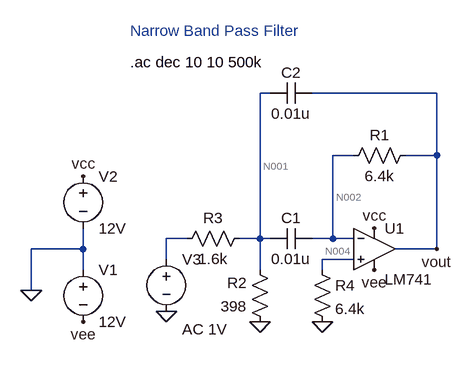
[diagram p0: schematic narrow_band_pass.asc]
narrow_band_pass.asc, the LTspice schematic file:
Version 4.1
SHEET 1 880 680
WIRE 400 -128 384 -128
WIRE 656 -128 464 -128
WIRE 528 -32 496 -32
WIRE 656 -32 656 -128
WIRE 656 -32 608 -32
WIRE 272 96 240 96
WIRE 384 96 384 -128
WIRE 384 96 352 96
WIRE 400 96 384 96
WIRE 496 96 496 -32
WIRE 496 96 464 96
WIRE 528 96 496 96
WIRE 112 112 112 80
WIRE 112 112 32 112
WIRE 656 112 656 -32
WIRE 656 112 592 112
WIRE 240 128 240 96
WIRE 528 128 480 128
WIRE 112 144 112 112
WIRE 384 144 384 96
WIRE 480 144 480 128
WIRE 32 176 32 112
FLAG 32 176 0
FLAG 480 224 0
FLAG 384 224 0
FLAG 240 208 0
FLAG 112 0 vcc
FLAG 560 80 vcc
FLAG 560 144 vee
FLAG 112 224 vee
FLAG 656 112 vout
SYMBOL voltage 112 128 R0
WINDOW 123 0 0 Left 0
WINDOW 39 0 0 Left 0
SYMATTR InstName V1
SYMATTR Value 12V
SYMBOL voltage 112 -16 R0
WINDOW 123 0 0 Left 0
WINDOW 39 0 0 Left 0
SYMATTR InstName V2
SYMATTR Value 12V
SYMBOL LM741 560 48 R0
WINDOW 3 16 111 Left 2
SYMATTR InstName U1
SYMBOL res 624 -48 R90
WINDOW 0 0 56 VBottom 2
WINDOW 3 32 56 VTop 2
SYMATTR InstName R1
SYMATTR Value 6.4k
SYMBOL res 400 240 R180
WINDOW 0 36 76 Left 2
WINDOW 3 36 40 Left 2
SYMATTR InstName R2
SYMATTR Value 398
SYMBOL res 256 112 R270
WINDOW 0 32 56 VTop 2
WINDOW 3 0 56 VBottom 2
SYMATTR InstName R3
SYMATTR Value 1.6k
SYMBOL res 464 128 R0
SYMATTR InstName R4
SYMATTR Value 6.4k
SYMBOL cap 464 80 R90
WINDOW 0 0 32 VBottom 2
WINDOW 3 32 32 VTop 2
SYMATTR InstName C1
SYMATTR Value 0.01u
SYMBOL cap 464 -144 R90
WINDOW 0 0 32 VBottom 2
WINDOW 3 32 32 VTop 2
SYMATTR InstName C2
SYMATTR Value 0.01u
SYMBOL voltage 240 112 R0
WINDOW 123 24 124 Left 2
WINDOW 39 0 0 Left 0
SYMATTR InstName V3
SYMATTR Value ""
SYMATTR Value2 AC 1V
TEXT 184 -224 Left 2 ;Narrow Band Pass Filter
TEXT 184 -176 Left 2 !.ac dec 10 10 500k

The netlist it stands for:
* narrow_band_pass.asc
V1 0 vee 12V
V2 vcc 0 12V
X§U1 N004 N002 vcc vee vout LM741  ; pins In+ In- V+ V- OUT
R1 vout N002 6.4k
R2 0 N001 398
R3 N003 N001 1.6k
R4 N004 0 6.4k
C1 N002 N001 0.01u
C2 vout N001 0.01u
V3 N003 0 AC 1V
* Narrow Band Pass Filter
.ac dec 10 10 500k
.lib LM741.lib
.backanno
.end

* Results of the author's LTspice run, read from the files saved beside the schematic
* Operating Point, zero values left out:
*   V(vcc) = 12 V
*   V(n002) = 629.7 µV
*   V(vout) = 1.282 mV
*   V(vee) = -12 V
*   V(n004) = -370.3 µV
*   I(V1) = -1.626 mA
*   I(R4) = -57.86 nA
*   I(V2) = -1.626 mA
*   I(R1) = 101.9 nA
*   Ix(u1:1) = 57.86 nA
*   Ix(u1:2) = 101.9 nA
*   Ix(u1:99) = 1.626 mA
*   Ix(u1:50) = -1.626 mA
*   Ix(u1:28) = -101.9 nA
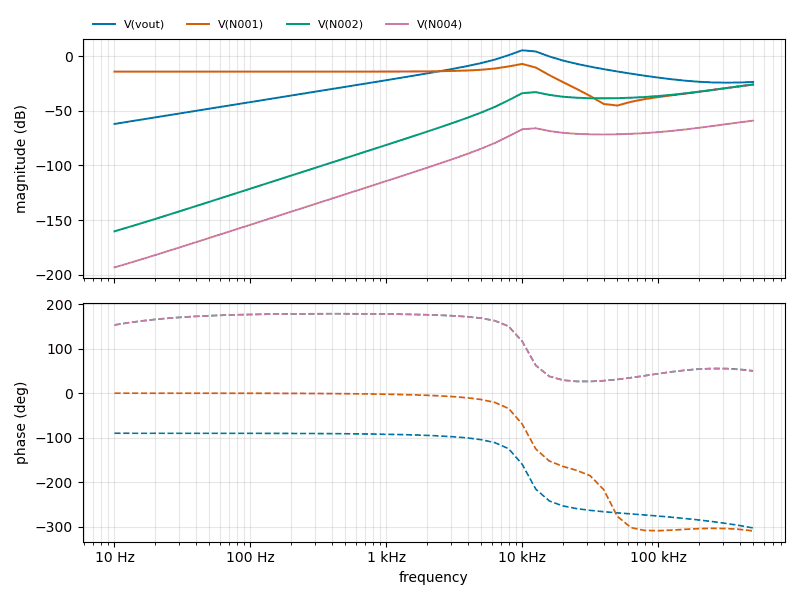
[diagram p1: AC Analysis of narrow_band_pass.asc, plotted from the saved traces]
* AC Analysis, 1 run:
*   V(vout): -61.93 dB at 10 Hz, -23.50 dB at 500 kHz, peak 5.53 dB at 10 kHz, 3 dB below the peak at 8.556 kHz and 13.88 kHz
*   V(N001): -14.01 dB at 10 Hz, -25.83 dB at 500 kHz, peak -6.95 dB at 10 kHz, 3 dB below the peak at 7.293 kHz and 12.33 kHz
*   V(N002): -160.29 dB at 10 Hz, -25.82 dB at 500 kHz, peak -25.82 dB at 500 kHz, 3 dB below the peak at 327.8 kHz
*   V(N004): -193.37 dB at 10 Hz, -58.90 dB at 500 kHz, peak -58.90 dB at 500 kHz, 3 dB below the peak at 327.8 kHz